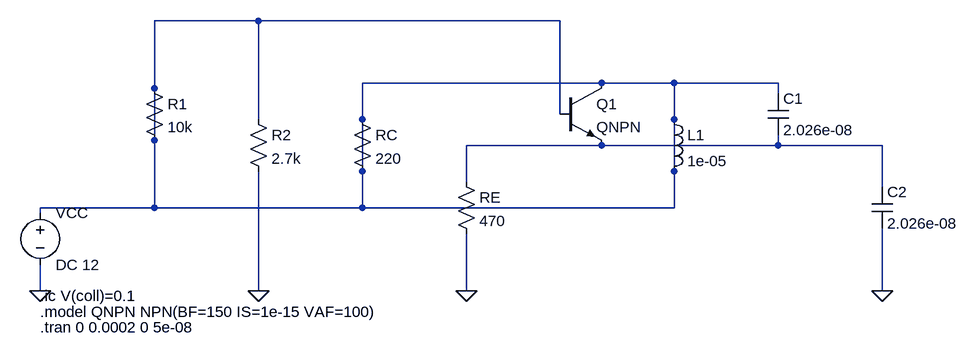
[diagram p0: schematic circuit.asc]
circuit.asc, the LTspice schematic file:
Version 4
SHEET 1 1760 880
SYMBOL voltage 128 376 R0
SYMATTR InstName VCC
SYMATTR Value DC 12
SYMBOL res 288 184 R0
SYMATTR InstName R1
SYMATTR Value 10k
SYMBOL res 448 232 R0
SYMATTR InstName R2
SYMATTR Value 2.7k
SYMBOL res 608 232 R0
SYMATTR InstName RC
SYMATTR Value 220
SYMBOL res 768 328 R0
SYMATTR InstName RE
SYMATTR Value 470
SYMBOL npn 928 192 R0
SYMATTR InstName Q1
SYMATTR Value QNPN
SYMBOL ind 1088 232 R0
SYMATTR InstName L1
SYMATTR Value 1e-05
SYMBOL cap 1248 208 R0
SYMATTR InstName C1
SYMATTR Value 2.026e-08
SYMBOL cap 1408 352 R0
SYMATTR InstName C2
SYMATTR Value 2.026e-08
WIRE 128 384 1104 384
WIRE 128 392 128 384
WIRE 128 472 128 512
WIRE 304 96 928 96
WIRE 304 200 304 384
WIRE 304 280 304 96
WIRE 464 248 464 96
WIRE 464 328 464 512
WIRE 624 192 1264 192
WIRE 624 248 624 384
WIRE 624 328 624 192
WIRE 784 288 1424 288
WIRE 784 344 784 288
WIRE 784 424 784 512
WIRE 928 240 928 96
WIRE 992 192 992 192
WIRE 992 288 992 288
WIRE 1104 248 1104 384
WIRE 1104 328 1104 192
WIRE 1264 208 1264 192
WIRE 1264 272 1264 288
WIRE 1424 352 1424 288
WIRE 1424 416 1424 512
FLAG 128 512 0
FLAG 464 512 0
FLAG 784 512 0
FLAG 1424 512 0
TEXT 128 520 Left 2 !.ic V(coll)=0.1
TEXT 128 544 Left 2 !.model QNPN NPN(BF=150 IS=1e-15 VAF=100)
TEXT 128 568 Left 2 !.tran 0 0.0002 0 5e-08

The netlist it stands for:
* circuit.asc
VCC N001 0 DC 12
R1 N001 N001 10k
R2 N001 0 2.7k
RC N001 N001 220
RE N002 0 470
Q1 N001 N001 N002 0 QNPN
L1 N001 N001 1e-05
C1 N001 N002 2.026e-08
C2 N002 0 2.026e-08
.model NPN NPN
.model PNP PNP
.lib standard.bjt
.ic V(coll)=0.1
.model QNPN NPN(BF=150 IS=1e-15 VAF=100)
.tran 0 0.0002 0 5e-08
.backanno
.end